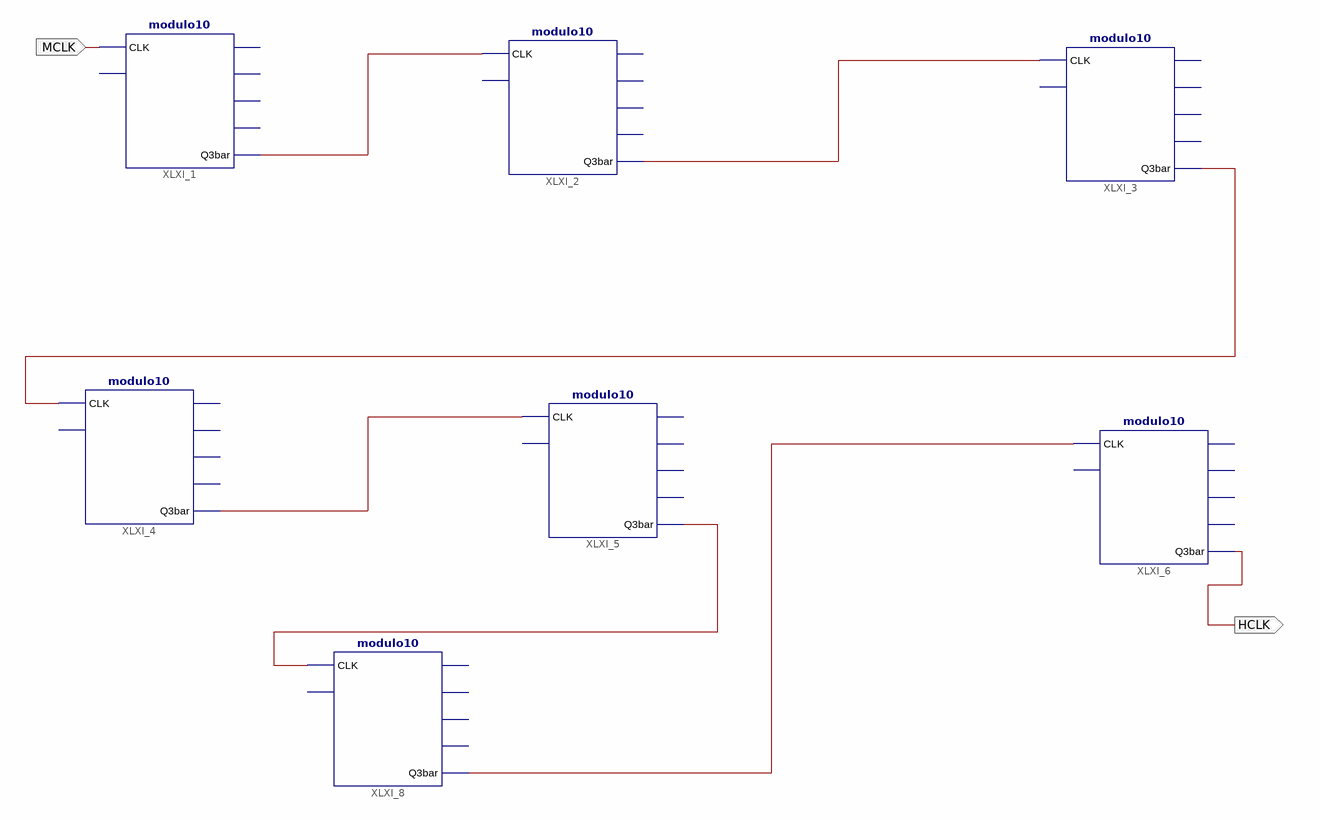
[diagram p0: schematic sheet 1]
// Xilinx ISE schematic FreqDown.sch (spartan6) as structural Verilog: 7 symbols, 2 ports
module FreqDown (
  input  MCLK,
  output HCLK
);

  wire XLXN_3, XLXN_4, XLXN_5, XLXN_6, XLXN_11, XLXN_12;

  modulo10 XLXI_1 (.CLK(MCLK), .Q3bar(XLXN_3));  // open: Q0, Q1, Q2, Q3, Reset
  modulo10 XLXI_2 (.CLK(XLXN_3), .Q3bar(XLXN_4));  // open: Q0, Q1, Q2, Q3, Reset
  modulo10 XLXI_3 (.CLK(XLXN_4), .Q3bar(XLXN_5));  // open: Q0, Q1, Q2, Q3, Reset
  modulo10 XLXI_4 (.CLK(XLXN_5), .Q3bar(XLXN_6));  // open: Q0, Q1, Q2, Q3, Reset
  modulo10 XLXI_5 (.CLK(XLXN_6), .Q3bar(XLXN_11));  // open: Q0, Q1, Q2, Q3, Reset
  modulo10 XLXI_6 (.CLK(XLXN_12), .Q3bar(HCLK));  // open: Q0, Q1, Q2, Q3, Reset
  modulo10 XLXI_8 (.CLK(XLXN_11), .Q3bar(XLXN_12));  // open: Q0, Q1, Q2, Q3, Reset
endmodule
